# EasyEDA schematic Airq_easyeda.json
TITLE: Airq_schematic; REV: 2.2; Date: 2021-09-12; Sheet: 1/1; Drawn By: Johannes v. Grundherr
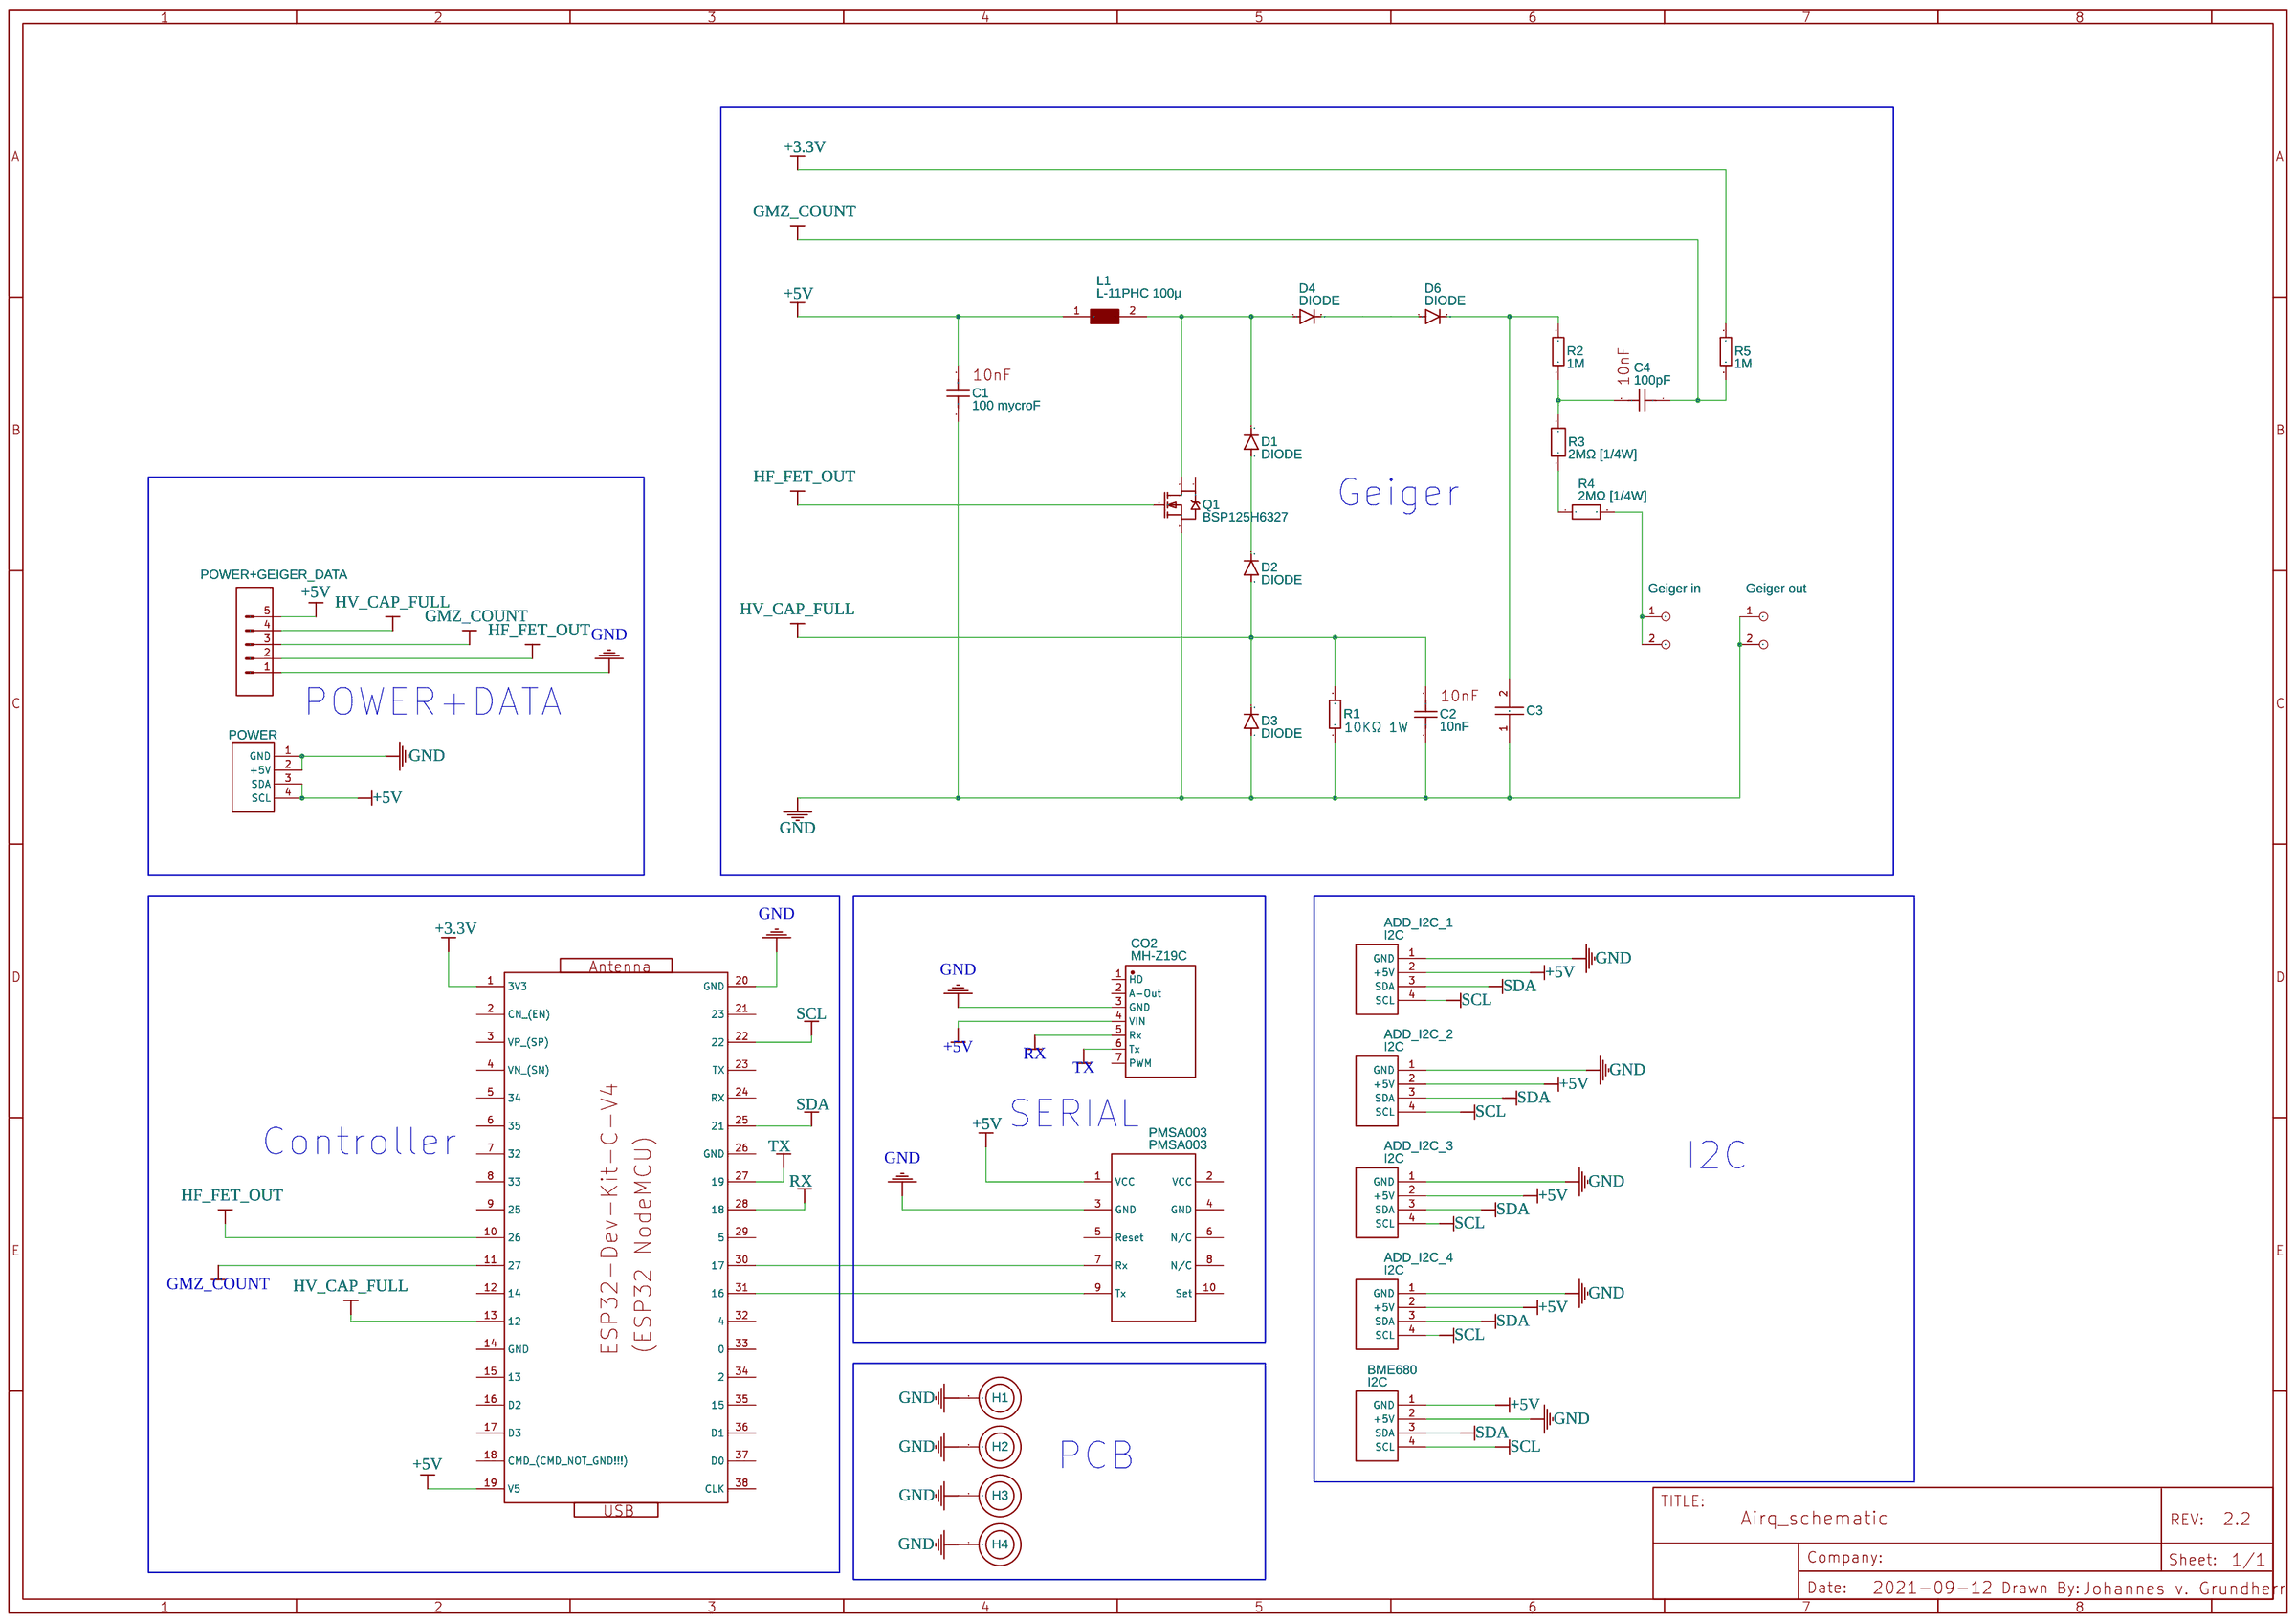
[diagram p0: schematic sheet]

## Parts
ADD_I2C_1  I2C  [HDR-M-2.54_1X4]
ADD_I2C_2  I2C  [HDR-M-2.54_1X4]
ADD_I2C_3  I2C  [HDR-M-2.54_1X4]
ADD_I2C_4  I2C  [HDR-M-2.54_1X4]
BME680  I2C  [HDR-M-2.54_1X4]
C1  100 mycroF  [10NF]
C2  10nF  [10NF]
C3  Wima, MKP4, 100nF, 630V  [WIMA,_MKP4,_100NF,_630V]
C4  100pF  [10NF]
CO2  MH-Z19C  [MH-Z19C]
D1  DIODE  [DIODE-1N4148-KIT]
D2  DIODE  [DIODE-1N4148-KIT]
D3  DIODE  [DIODE-1N4148-KIT]
D4  DIODE  [DIODE-1N4148-KIT]
D6  DIODE  [DIODE-1N4148-KIT]
H1  HoleHole  [HOLEHOLE]
H2  HoleHole  [HOLEHOLE]
H3  HoleHole  [HOLEHOLE]
H4  HoleHole  [HOLEHOLE]
JP1  Geiger in  [HDR1X2]
JP2  Geiger out  [HDR1X2]
L1  L-11PHC 100µ  [11PHC-RM5-12D]
PMSA003  PMSA003  [PMSA003]
POWER  Power  [HDR-M-2.54_1X4]
POWER+GEIGER_DATA  POWER+GEIGER_DATA  [5 PIN HEADER]
Q1  BSP125H6327  [SOT-223-4_L6.5-W3.5-P2.30-LS7.0-BR]
R1  10KΩ 1W  [RES-TH_BD2.5-L6.5-P10.50-D0.6]
R2  1M  [RES-TH_BD2.5-L6.5-P10.50-D0.6]
R3  2MΩ [1/4W]  [RC-TH_1/4W[1/2WS]]
R4  2MΩ [1/4W]  [RC-TH_1/4W[1/2WS]]
R5  1M  [RES-TH_BD2.5-L6.5-P10.50-D0.6]
U1  AZDelivery_ESP32_NodeMCU  [AZ-DELIVERY ESP32 NODEMCU MODULE]

## Library data of the parts
ADD_I2C_1-ADD_I2C_4 BME680 POWER = I2C: Contributor: paultwick
C1 C2 C4 = 10nF: Contributor: Shant Centistoke
C3 = Wima, MKP4, 100nF, 630V: Contributor: Hotte
CO2 = MH-Z19C: Contributor: Ralf-Michael von Prondzinski; Supplier Part: https://github.com/WifWaf/MH-Z19/tree/master/examples/BasicUsage; Manufacturer: Winsen; Package Display: No
D1-D4 D6 = DIODE: Diode
H1-H4 = HoleHole: Contributor: Cillié Malan
JP1 JP2 = 2 Pin Header: Contributor: Adafruit; sourceId: 0SMGAR9rl
L1 = L-11PHC 100µ: link: https://www.reichelt.de/stehende-induktivitaet-11phc-ferrit-100-h-l-11phc-100-p138670.html?&trstct=pol_2; Contributor: Bagger
PMSA003 = PMSA003: Contributor: rajsiman; Supplier: Plantower; link: http://www.plantower.com/content/?125.html
POWER+GEIGER_DATA = Header 5pin: 5 x 0.1 inch Header; Contributor: SparkFun; sourceId: JcMKkUSPp
Q1 = BSP125H6327: Supplier: LCSC; Supplier Part: C123756; Manufacturer: Infineon Technologies; Contributor: LCSC; JLCPCB Part Class: Extended Part
R1 R2 R5 = 1M OHM: Supplier: LCSC; Manufacturer: UniOhm; Manufacturer Part: MFR0W4F1004A50; Supplier Part: C58596
R3 R4 = 4.7MΩ [1/4W]: Supplier Part: C720290; Supplier: LCSC; Contributor: Harwave Technologies
U1 = AZDelivery_ESP32_NodeMCU: Contributor: Andreas Riepl

## Nets
+3.3V: R5.1 U1.1(3V3)
+5V: ADD_I2C_1.2(+5V) ADD_I2C_2.2(+5V) ADD_I2C_3.2(+5V) ADD_I2C_4.2(+5V) BME680.1(GND) C1.2 CO2.4(VIN) L1.1 PMSA003.1(VCC) POWER.3(SDA) POWER.4(SCL) POWER+GEIGER_DATA.5(1) U1.19(V5)
GND: ADD_I2C_1.1(GND) ADD_I2C_2.1(GND) ADD_I2C_3.1(GND) ADD_I2C_4.1(GND) BME680.2(+5V) C1.1 C2.1 C3.1 CO2.3(GND) D3.A H1.1 H2.1 H3.1 H4.1 JP2.1 JP2.2 PMSA003.3(GND) POWER.1(GND) POWER.2(+5V) POWER+GEIGER_DATA.1 Q1.3(S) R1.1 U1.20(GND)
GMZ_COUNT: C4.1 POWER+GEIGER_DATA.3(1) R5.2 U1.11(27)
HF_FET_OUT: POWER+GEIGER_DATA.2 Q1.1(G) U1.10(26)
HV_CAP_FULL: C2.2 D2.A D3.C POWER+GEIGER_DATA.4(2) R1.2 U1.13(12)
RX: CO2.5(Rx) U1.28(18)
SCL: ADD_I2C_1.4(SCL) ADD_I2C_2.4(SCL) ADD_I2C_3.4(SCL) ADD_I2C_4.4(SCL) BME680.4(SCL) U1.22
SDA: ADD_I2C_1.3(SDA) ADD_I2C_2.3(SDA) ADD_I2C_3.3(SDA) ADD_I2C_4.3(SDA) BME680.3(SDA) U1.25(21)
TX: CO2.6(Tx) U1.27(19)
Net-(C3-2): C3.2 D6.C R2.2
Net-(C4-2): C4.2 R2.1 R3.2
Net-(D1-A): D1.A D2.C
Net-(D1-C): D1.C D4.A L1.2 Q1.2(D)
Net-(D4-C): D4.C D6.A
Net-(JP1-1): JP1.1 JP1.2 R4.2
Net-(PMSA003-7): PMSA003.7(Rx) U1.30(17)
Net-(PMSA003-9): PMSA003.9(Tx) U1.31(16)
Net-(R3-1): R3.1 R4.1

Not connected (* = marked no-connect by the designer): CO2 1(HD) 2(A-Out) 7(PWM); PMSA003 2(VCC) 4(GND) 5(Reset) 6(N/C) 8(N/C) 10(Set); Q1 4(D); U1 2(CN (EN)) 3(VP (SP)) 4(VN (SN)) 5(34) 6(35) 7(32) 8(33) 9(25) 12(14) 14(GND) 15(13) 16(D2) 17(D3) 18(CMD (CMD NOT GND!!!)) 21(23) 23(TX) 24(RX) 26(GND) 29(5) 32(4) 33(0) 34(2) 35(15) 36(D1) 37(D0) 38(CLK)

## Notes on the sheet
- Geiger
- POWER+DATA
- SERIAL
- Controller
- I2C
- PCB
